# EAGLE design board_1.2v (EAGLE 7.7.0)
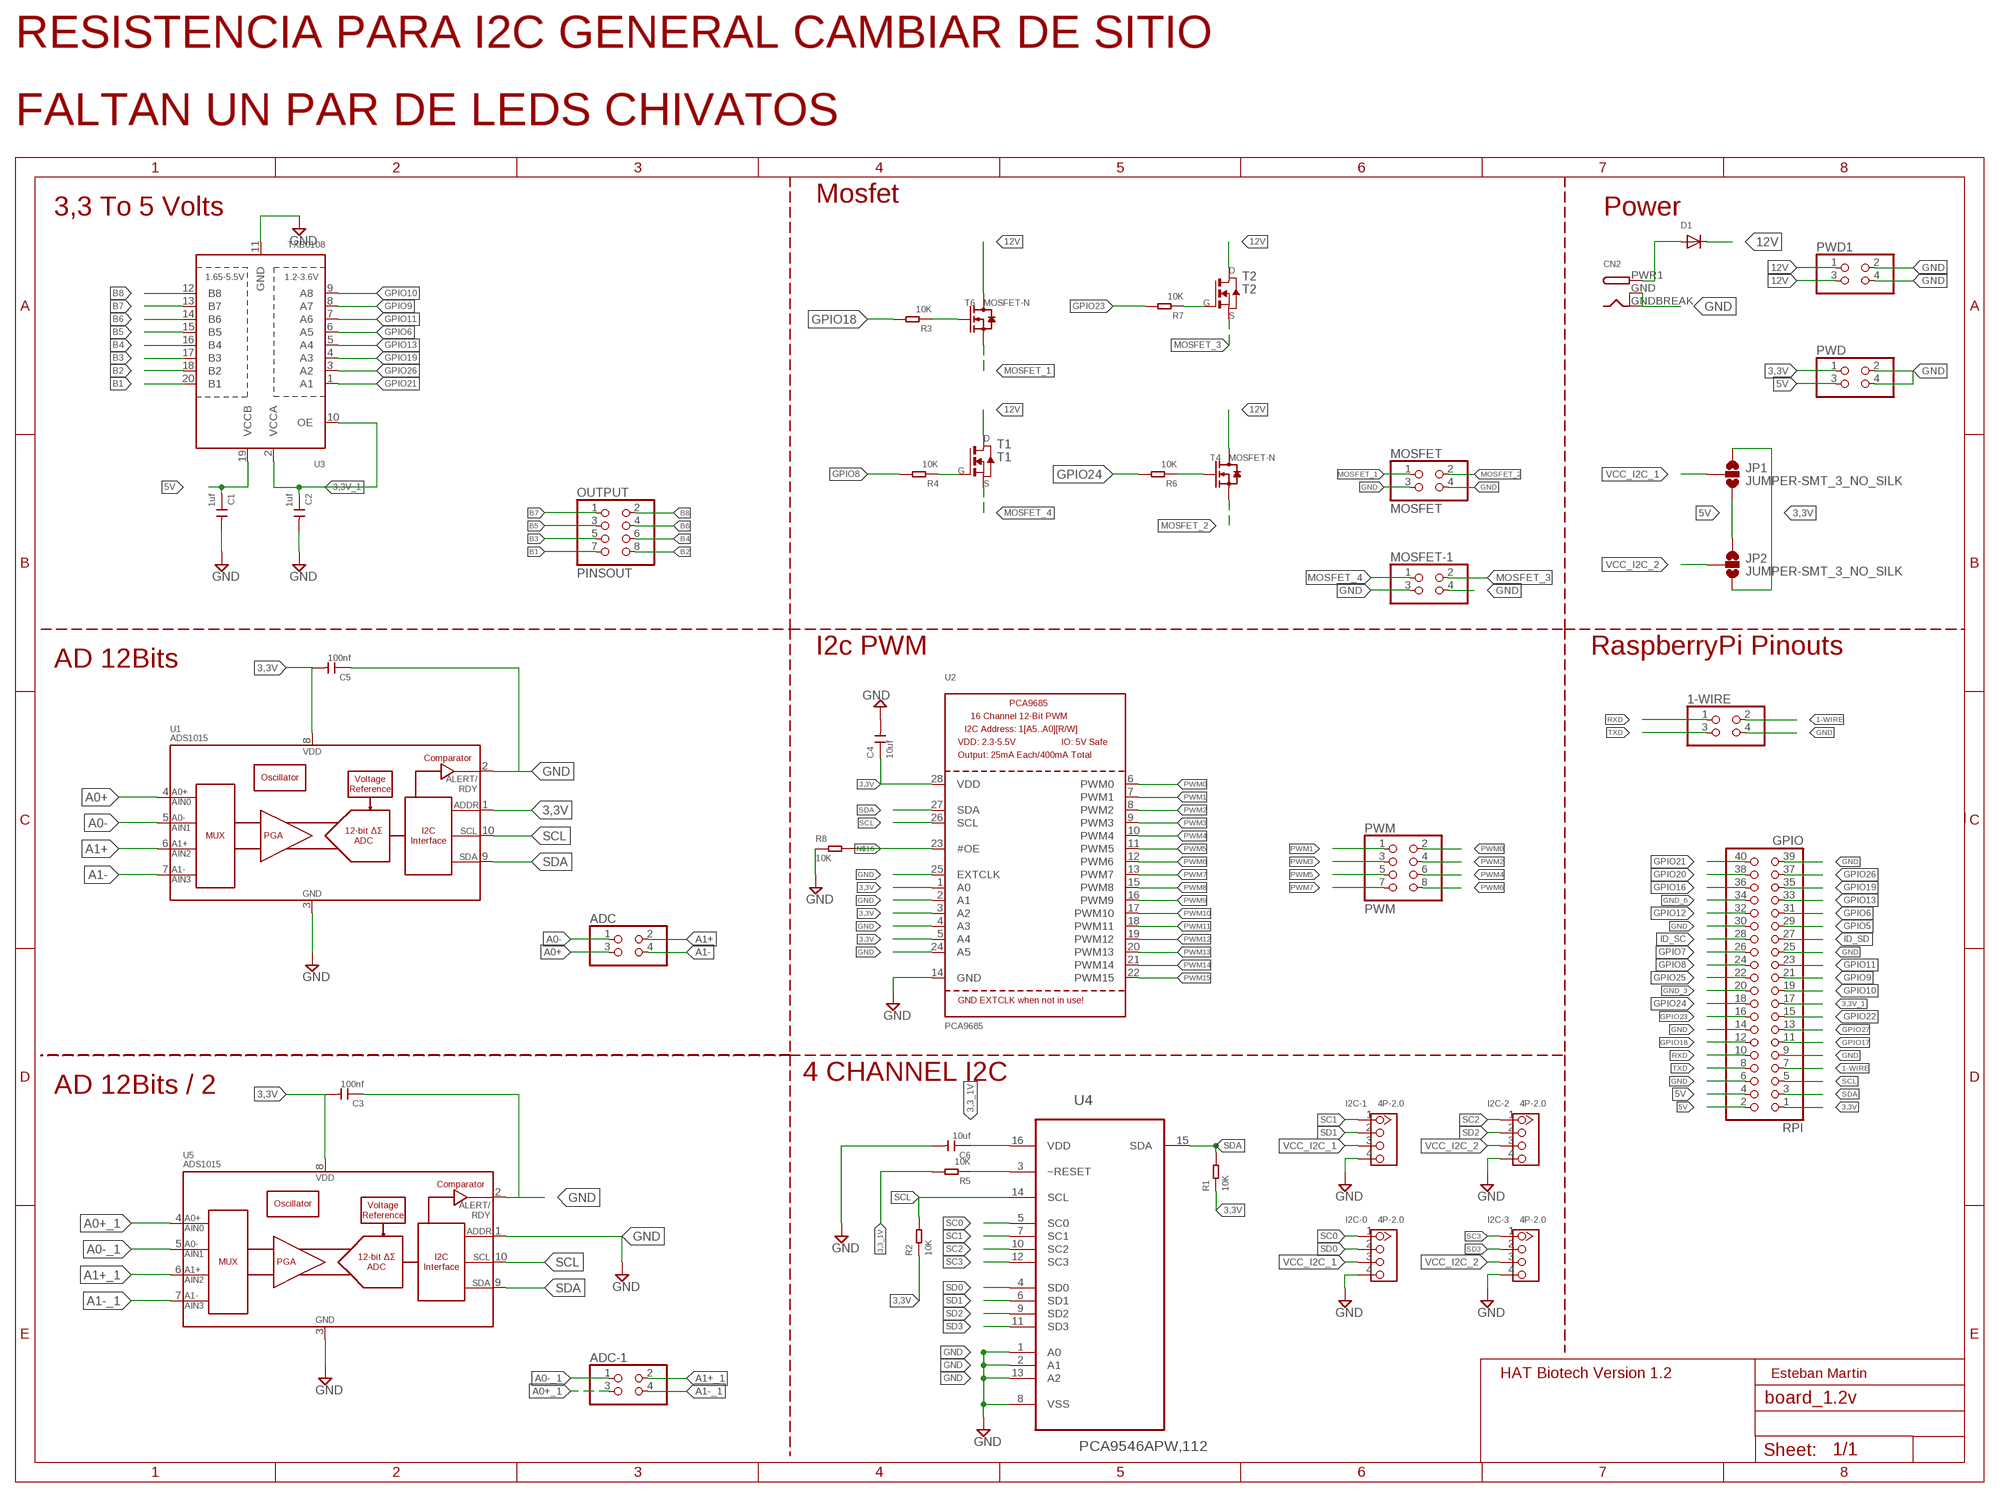
[diagram p0: schematic, sheet 1]

## Parts
1-WIRE  PINHD-2X2  [2X02]
ADC  PINHD-2X2  [2X02]
ADC-1  PINHD-2X2  [2X02]
C1  1uf  CERAMIC-1UF-25V-10%-X7R(0805)  [C0805]
C2  1uf  CERAMIC-1UF-25V-10%-X7R(0805)  [C0805]
C3  100nf  CERAMIC-100NF-50V-10%-X7R(0805)  [C0805]
C4  10uf  CERAMIC-1UF-25V-10%-X7R(0805)  [C0805]
C5  100nf  CERAMIC-100NF-50V-10%-X7R(0805)  [C0805]
C6  10uf  CERAMIC-1UF-25V-10%-X7R(0805)  [C0805]
CN2  DCBARRELSMT  [DCJACK_2MM_SMT]
D1  DIODESOD-123  [SOD-123]
I2C-0  4P-2.0  GROVE-CONNECTOR-DIP(4P-2.0)  [HW4-2.0]
I2C-1  4P-2.0  GROVE-CONNECTOR-DIP(4P-2.0)  [HW4-2.0]
I2C-2  4P-2.0  GROVE-CONNECTOR-DIP(4P-2.0)  [HW4-2.0]
I2C-3  4P-2.0  GROVE-CONNECTOR-DIP(4P-2.0)  [HW4-2.0]
JP1  JUMPER-SMT_3_NO_SILK  [SMT-JUMPER_3_NO_SILK]
JP2  JUMPER-SMT_3_NO_SILK  [SMT-JUMPER_3_NO_SILK]
MOSFET  MOSFET  PINHD-2X2  [2X02]
MOSFET-1  PINHD-2X2  [2X02]
OUTPUT  PINSOUT  PINHD-2X4  [2X04]
PWD  PINHD-2X2  [2X02]
PWD1  PINHD-2X2  [2X02]
PWM  PWM  PINHD-2X4  [2X04]
R1  10K  SMD-RES-10K-1%-1/8W(0805)  [R0805]
R2  10K  SMD-RES-10K-1%-1/8W(0805)  [R0805]
R3  10K  SMD-RES-10K-1%-1/8W(0805)  [R0805]
R4  10K  SMD-RES-10K-1%-1/8W(0805)  [R0805]
R5  10K  SMD-RES-10K-1%-1/8W(0805)  [R0805]
R6  10K  SMD-RES-10K-1%-1/8W(0805)  [R0805]
R7  10K  SMD-RES-10K-1%-1/8W(0805)  [R0805]
R8  10K  SMD-RES-10K-1%-1/8W(0805)  [R0805]
RPI  GPIO  PINHD-2X20  [2X20]
T1  T1  NMOSFETTO252  [TO252]
T2  T2  NMOSFETTO252  [TO252]
T4  MOSFET-N  [SOT-23]
T6  MOSFET-N  [SOT-23]
U1  ADS1015  [MSOP10]
U2  PCA9685  [TSSOP28]
U3  TXB0108  TXB0108PWR  [TSSOP20]
U4  PCA9546APW,112  [SOP65P640X110-16N]
U5  ADS1015  [MSOP10]

## Nets
1-WIRE: 1-WIRE.2 RPI.7
3,3_1V: C6.1 R5.2 U4.16(VDD)
3,3V: C3.2 C4.1 C5.2 JP1.1 JP2.3 PWD.1 R1.1 R2.1 RPI.1 U1.1(ADDR) U1.8(VDD) U2.1(A0) U2.3(A2) U2.5(A4) U2.28(VDD) U5.8(VDD)
3,3V_1: C2.1 RPI.17 U3.2(VCCA) U3.10(OE)
5V: C1.1 JP1.3 JP2.1 PWD.3 RPI.2 RPI.4 U3.19(VCCB)
12V: D1.C PWD1.1 PWD1.3 T1.3(D) T2.3(D) T4.3(D) T6.3(D)
A0+: ADC.3 U1.4(AIN0)
A0+_1: ADC-1.3 U5.4(AIN0)
A0-: ADC.1 U1.5(AIN1)
A0-_1: ADC-1.1 U5.5(AIN1)
A1+: ADC.2 U1.6(AIN2)
A1+_1: ADC-1.2 U5.6(AIN2)
A1-: ADC.4 U1.7(AIN3)
A1-_1: ADC-1.4 U5.7(AIN3)
B1: OUTPUT.7 U3.20(B1)
B2: OUTPUT.8 U3.18(B2)
B3: OUTPUT.5 U3.17(B3)
B4: OUTPUT.6 U3.16(B4)
B5: OUTPUT.3 U3.15(B5)
B6: OUTPUT.4 U3.14(B6)
B7: OUTPUT.1 U3.13(B7)
B8: OUTPUT.2 U3.12(B8)
GND: 1-WIRE.4 C1.2 C2.2 C3.1 C4.2 C5.1 C6.2 CN2.GND(GNDBREAK) CN2.GNDBREAK(GND) I2C-0.4 I2C-1.4 I2C-2.4 I2C-3.4 MOSFET-1.3 MOSFET-1.4 MOSFET.3 MOSFET.4 PWD1.2 PWD1.4 PWD.2 PWD.4 R8.1 RPI.6 RPI.9 RPI.14 RPI.25 RPI.30 RPI.39 U1.2(ALERT/RDY) U1.3(VSS) U2.2(A1) U2.4(A3) U2.14(GND) U2.24(A5) U2.25(EXTCLK) U3.11(GND) U4.1(A0) U4.2(A1) U4.8(VSS) U4.13(A2) U5.1(ADDR) U5.2(ALERT/RDY) U5.3(VSS)
GND_3: RPI.20
GND_6: RPI.34
GPIO5: RPI.29
GPIO6: RPI.31 U3.6(A5)
GPIO7: RPI.26
GPIO8: R4.2 RPI.24
GPIO9: RPI.21 U3.8(A7)
GPIO10: RPI.19 U3.9(A8)
GPIO11: RPI.23 U3.7(A6)
GPIO12: RPI.32
GPIO13: RPI.33 U3.5(A4)
GPIO16: RPI.36
GPIO17: RPI.11
GPIO18: R3.2 RPI.12
GPIO19: RPI.35 U3.4(A3)
GPIO20: RPI.38
GPIO21: RPI.40 U3.1(A1)
GPIO22: RPI.15
GPIO23: R7.2 RPI.16
GPIO24: R6.2 RPI.18
GPIO25: RPI.22
GPIO26: RPI.37 U3.3(A2)
GPIO27: RPI.13
ID_SC: RPI.28
ID_SD: RPI.27
MOSFET_1: MOSFET.1 T6.2(S)
MOSFET_2: MOSFET.2 T4.2(S)
MOSFET_3: MOSFET-1.2 T2.2(S)
MOSFET_4: MOSFET-1.1 T1.2(S)
N$2: CN2.PWR1(PWR) D1.A
N$6: R3.1 T6.1(G)
N$7: R5.1 U4.3(~RESET)
N$9: R4.1 T1.1(G)
N$10: R6.1 T4.1(G)
N$11: R7.1 T2.1(G)
N$16: R8.2 U2.23(#OE)
PWM0: PWM.2 U2.6(PWM0)
PWM1: PWM.1 U2.7(PWM1)
PWM2: PWM.4 U2.8(PWM2)
PWM3: PWM.3 U2.9(PWM3)
PWM4: PWM.6 U2.10(PWM4)
PWM5: PWM.5 U2.11(PWM5)
PWM6: PWM.8 U2.12(PWM6)
PWM7: PWM.7 U2.13(PWM7)
PWM8: U2.15(PWM8)
PWM9: U2.16(PWM9)
PWM10: U2.17(PWM10)
PWM11: U2.18(PWM11)
PWM12: U2.19(PWM12)
PWM13: U2.20(PWM13)
PWM14: U2.21(PWM14)
PWM15: U2.22(PWM15)
RXD: 1-WIRE.1 RPI.10
SC0: I2C-0.1 U4.5(SC0)
SC1: I2C-1.1 U4.7(SC1)
SC2: I2C-2.1 U4.10(SC2)
SC3: I2C-3.1 U4.12(SC3)
SCL: R2.2 RPI.5 U1.10(SCL) U2.26(SCL) U4.14(SCL) U5.10(SCL)
SD0: I2C-0.2 U4.4(SD0)
SD1: I2C-1.2 U4.6(SD1)
SD2: I2C-2.2 U4.9(SD2)
SD3: I2C-3.2 U4.11(SD3)
SDA: R1.2 RPI.3 U1.9(SDA) U2.27(SDA) U4.15(SDA) U5.9(SDA)
TXD: 1-WIRE.3 RPI.8
VCC_I2C_1: I2C-0.3 I2C-1.3 JP1.2
VCC_I2C_2: I2C-2.3 I2C-3.3 JP2.2

## Notes on the sheet
- RESISTENCIA PARA I2C GENERAL CAMBIAR DE SITIO
- FALTAN UN PAR DE LEDS CHIVATOS
- Mosfet
- 3,3 To 5 Volts | Power
- I2c PWM | RaspberryPi Pinouts
- AD 12Bits
- 4 CHANNEL I2C
- AD 12Bits / 2
- HAT Biotech Version 1.2 | Esteban Martin

## Library data of the parts
1-WIRE ADC ADC-1 MOSFET MOSFET-1 PWD PWD1 = pinhead:PINHD-2X2: PIN HEADER
C1 C2 = Seeed-OPL-Capacitor:CERAMIC-1UF-25V-10%-X7R(0805): 302010179; MPN: CC0805KKX7R8BB105
C3 C5 = Seeed-OPL-Capacitor:CERAMIC-100NF-50V-10%-X7R(0805): 302010165; MPN: CC0805KRX7R9BB104
C4 C6 = Seeed-OPL-Capacitor:CERAMIC-1UF-25V-10%-X7R(0805): 302010179; MPN: CC0805KKX7R8BB105; VALUE: 1uf
CN2 = adafruit:DCBARREL: 2.0mm DC Barrel Jack DCJACK_2MM_PTH - Through Hole Jack (4UConnector: 05537)
D1 = adafruit:DIODE: Diode SMADIODE - SMA Surface Mount Package 20V 1A Schottky Diode Digikey: 641-1014-6-ND DO-1N4148 - Through Hole Small Current Diode SOD-123 20V 1 A (.5mV Vf) Schottky Diode - Digikey: MBRX120TPMSCT-ND SOD-323 10V 570mA (.38mV Vf, 3ns) Schottky Diode - Digikey: ZLLS410CT-ND SOD-523 30V 30mA Schottky Diode (RB751S-40TE61) - Digikey: RB751S-40TE61CT-ND SOT23-R/W - SOT23 Package (R = Solder Paste/Reflow Ovens, W = Hand-Soldering) BAT54Film 40V 300mA - Digikey: 497-7162-1-ND
I2C-0 I2C-1-I2C-3 = Seeed-OPL-Connector:GROVE-CONNECTOR-DIP(4P-2.0): 320110033
JP1 JP2 = SparkFun-Jumpers:JUMPER-SMT_3_NO: Normally open jumper This jumper has three pads in close proximity to each other. Apply solder to close the connection(s).
OUTPUT PWM = adafruit:PINHD-2X4: PIN HEADER
R1-R8 = Seeed-OPL-Resistor:SMD-RES-10K-1%-1/8W(0805): 301010361; MPN: RC0805FR-0710KL
RPI = adafruit:PINHD-2X20: PIN HEADER
T1 T2 = fab_2:NMOSFET: MOS FET
T4 T6 = Seeed-OPL-Transistor:MOSFET-N
U1 U5 = SparkFun-IC-Conversion:ADS1015: ADS1015 12-BIT ADC 12-Bit Del-Sig ADC Four single-ended inputs or two differential inputs Internal PGA I2C interface 2.0-5.5V SparkFun Products SparkFun Block for Intel Edison - ADC <https://www.sparkfun.com/products/13770> (DEV-13770); PROD_ID: IC-12270
U2 = adafruit:PCA9685: PCA9685 - 16 Channel 12-Bit I2C PWM Controller 5.0V tolerant 16 channel, 12-bit I2C PWM controller with 25mA per output (max. 400mA total) Digikey: 568-5931-1-ND
U3 = adafruit:TXB0108PWR: 8-Bit Bi-Directional Level Shifter 1.2V-3.6V (VCCA) to 1.65V-5.5V (VCCB) bi-directional level shifter with auto direction sensing. Max data rate - VCCA 1.8V: 20Mbps (50ns), VCCA 3.3V: 100Mbps (10ns) Digikey: 296-21527-1-ND
U4 = NXP_By_element14_Batch_1:PCA9546APW,112: 4-channel I2C-bus switch with reset; MPN: PCA9546APW,112; OC_FARNELL: 1831208; OC_NEWARK: 70R6610; PACKAGE: TSSOP-16; SUPPLIER: NXP

## Board
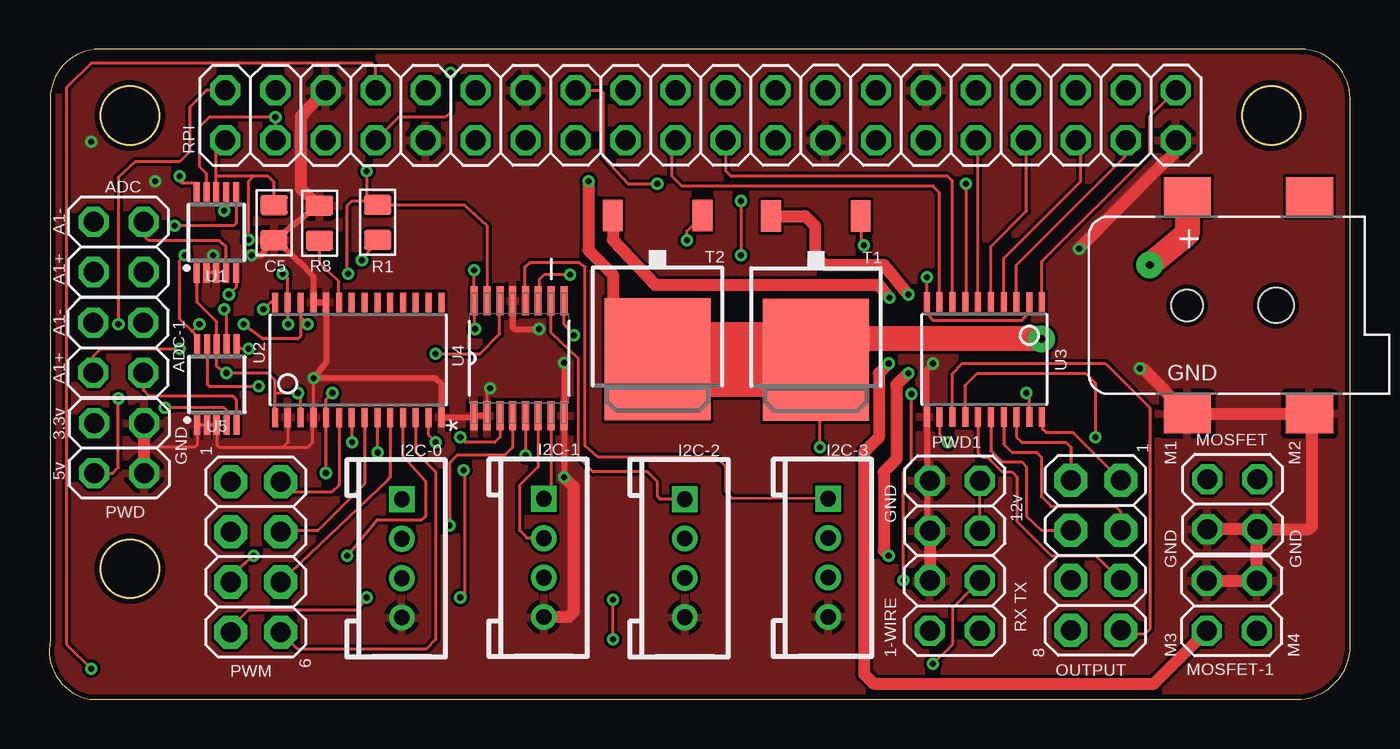
[diagram p1: board, top side]
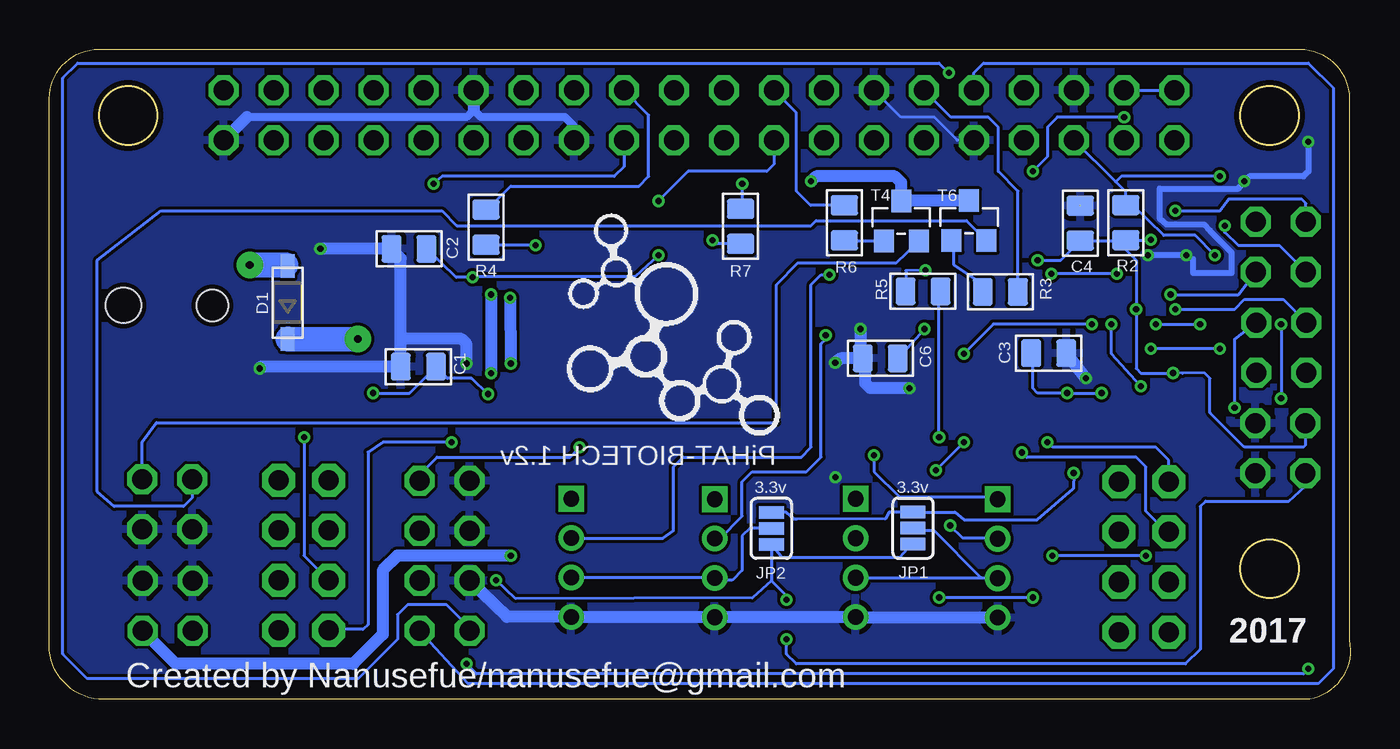
[diagram p2: board, bottom side, seen from below]

Size 66.06 x 33 mm. Coordinates in mm from the lower left corner, seen from the top.
Outline: 0.05,30.5 0.05,3 arc90 2.05,0 63.55,0 arc90 66.05,3 66.05,30.5 arc90 63.55,33 2.55,33 arc90 0.05,30.5
Outline: circle at 62.05,29.64 radius 1.48
Outline: circle at 4.09,29.64 radius 1.48
Outline: circle at 4.09,6.63 radius 1.48
Copper layers (1*16): Top 0.035mm / dielectric 1.5mm / Bottom 0.035mm
Design rules "SeeedStudio_2layer_DRU_no_angle_20140221": minimum track width 6mil, minimum drill 12mil, track to track 6mil, track to pad 6mil, pad to pad 6mil, via to via 6mil, smd to smd 0mil, copper to edge 10mil, drill to drill 10mil, minimum pad ring 10mil, minimum via ring 6mil, stop-mask expansion 2mil, vias tented up to drill 100mil, thermal gap 10mil

### Footprints (pad centres in the part's own frame; a part is rotated, then mirrored left to right if it is on the bottom)
2X02 = drill 1.016 octagon: 1 -1.27,-1.27; 2 -1.27,1.27; 3 1.27,-1.27; 4 1.27,1.27
C0805 = smd 1.397 x 1.016: 1 0,0.889; 2 0,-0.889
DCJACK_2MM_SMT = smd 2.4 x 2: GND 0,-5.5; GNDBREAK 6.2,-5.5; PWR1 0,5.5; PWR2 6.2,5.5 | hole 1.6: 0,0 | hole 1.8: 4.5,0
SOD-123 = smd 1.2 x 0.7: A 1.85,0; C -1.85,0
HW4-2.0 = drill 0.8 pad 1.27 square: 1 -3,0 | drill 0.8 pad 1.27: 2 -1,0; 3 1,0; 4 3,0
SMT-JUMPER_3_NO_SILK = smd 0.635 x 1.27: 1 -0.813,0; 2 0,0; 3 0.813,0
2X04 = drill 1.016 pad 1.676 octagon: 1 -3.81,-1.27; 2 -3.81,1.27; 3 -1.27,-1.27; 4 -1.27,1.27; 5 1.27,-1.27; 6 1.27,1.27; 7 3.81,-1.27; 8 3.81,1.27
R0805 = smd 1.397 x 1.016: 1 0,0.889; 2 0,-0.889
2X20 = drill 1.016 octagon: 1 -24.13,-1.27; 2 -24.13,1.27; 3 -21.59,-1.27; 4 -21.59,1.27; 5 -19.05,-1.27; 6 -19.05,1.27; 7 -16.51,-1.27; 8 -16.51,1.27; 9 -13.97,-1.27; 10 -13.97,1.27; 11 -11.43,-1.27; 12 -11.43,1.27; 13 -8.89,-1.27; 14 -8.89,1.27; 15 -6.35,-1.27; 16 -6.35,1.27; 17 -3.81,-1.27; 18 -3.81,1.27; 19 -1.27,-1.27; 20 -1.27,1.27; 21 1.27,-1.27; 22 1.27,1.27; 23 3.81,-1.27; 24 3.81,1.27; 25 6.35,-1.27; 26 6.35,1.27; 27 8.89,-1.27; 28 8.89,1.27; 29 11.43,-1.27; 30 11.43,1.27; 31 13.97,-1.27; 32 13.97,1.27; 33 16.51,-1.27; 34 16.51,1.27; 35 19.05,-1.27; 36 19.05,1.27; 37 21.59,-1.27; 38 21.59,1.27; 39 24.13,-1.27; 40 24.13,1.27
TO252 = smd 1 x 1.6: 1 -2.28,-4.8; 2 2.28,-4.8 | smd 5.4 x 6.2: 3 0,2.5
SOT-23 = smd 1.016 x 1.143: 1 -0.889,-1.016; 2 0.889,-1.016; 3 0,1.016
MSOP10 = smd 0.3 x 1: 1 -1,-2.05; 2 -0.5,-2.05; 3 0,-2.05; 4 0.5,-2.05; 5 1,-2.05; 6 1,2.05; 7 0.5,2.05; 8 0,2.05; 9 -0.5,2.05; 10 -1,2.05
TSSOP28 = smd 0.305 x 0.991: 1 -4.225,-2.918; 2 -3.575,-2.918; 3 -2.925,-2.918; 4 -2.275,-2.918; 5 -1.625,-2.918; 6 -0.975,-2.918; 7 -0.325,-2.918; 8 0.325,-2.918; 9 0.975,-2.918; 10 1.625,-2.918; 11 2.275,-2.918; 12 2.925,-2.918; 13 3.575,-2.918; 14 4.225,-2.918; 15 4.225,2.918; 16 3.575,2.918; 17 2.925,2.918; 18 2.275,2.918; 19 1.625,2.918; 20 0.975,2.918; 21 0.325,2.918; 22 -0.325,2.918; 23 -0.975,2.918; 24 -1.625,2.918; 25 -2.275,2.918; 26 -2.925,2.918; 27 -3.575,2.918; 28 -4.225,2.918
TSSOP20 = smd 0.305 x 0.991: 1 -2.925,-2.918; 2 -2.275,-2.918; 3 -1.625,-2.918; 4 -0.975,-2.918; 5 -0.325,-2.918; 6 0.325,-2.918; 7 0.975,-2.918; 8 1.625,-2.918; 9 2.275,-2.918; 10 2.925,-2.918; 11 2.925,2.918; 12 2.275,2.918; 13 1.625,2.918; 14 0.975,2.918; 15 0.325,2.918; 16 -0.325,2.918; 17 -0.975,2.918; 18 -1.625,2.918; 19 -2.275,2.918; 20 -2.925,2.918
SOP65P640X110-16N = smd 1.473 x 0.356: 1 -2.921,2.286; 2 -2.921,1.626; 3 -2.921,0.965; 4 -2.921,0.33; 5 -2.921,-0.33; 6 -2.921,-0.965; 7 -2.921,-1.626; 8 -2.921,-2.286; 9 2.921,-2.286; 10 2.921,-1.626; 11 2.921,-0.965; 12 2.921,-0.33; 13 2.921,0.33; 14 2.921,0.965; 15 2.921,1.626; 16 2.921,2.286

### Placement (x,y rotation side)
1-WIRE  45.98,4.76 90 top
ADC  3.52,22.96 90 top
ADC-1  3.51,17.86 90 top
C1  47.32,16.89 270 bottom
C2  47.8,22.87 270 bottom
C3  15.32,17.57 270 bottom
C4  13.72,24.18 180 bottom
C5  11.41,24.2 180 top
C6  23.86,17.31 270 bottom
CN2  57.79,20 0 top
D1  53.95,20.14 90 bottom
I2C-0  17.9,7.16 270 top
I2C-1  25.12,7.18 270 top
I2C-2  32.27,7.16 270 top
I2C-3  39.55,7.19 270 top
JP1  22.2,8.7 270 bottom
JP2  29.39,8.68 90 bottom
MOSFET  60.08,9.91 270 top
MOSFET-1  60.05,4.75 90 top
OUTPUT  53.13,7.31 90 top
PWD  3.54,12.76 270 top
PWD1  45.99,9.83 90 top
PWM  10.48,7.23 270 top
R1  16.68,24.21 180 top
R2  11.4,24.2 180 bottom
R3  17.77,20.69 90 bottom
R4  43.89,23.97 180 bottom
R5  21.69,20.71 270 bottom
R6  25.68,24.19 180 bottom
R7  30.95,24.01 180 bottom
R8  13.72,24.17 0 top
RPI  33.07,29.65 0 top
T1  38.93,19.73 180 top
T2  30.89,19.76 180 top
T4  22.8,24.28 0 bottom
T6  19.36,24.3 0 bottom
U1  8.49,23.7 0 top
U2  15.69,17.24 0 top
U3  47.49,17.26 180 top
U4  23.86,17.32 90 top
U5  8.51,15.98 0 top

### Tracks (layer width: path | path; a pad name or v marks a point on that pad's centre or on a via)
1-WIRE  (via drill 0.31)
  Top 0.16: v20.37,31.8 20.37,29.8 20.12,29.55 17.74,29.55 RPI.7
  Bottom 0.16: 1-WIRE.2 44.71,3.63 45.87,4.8 47.87,4.8 48.37,4.3 48.37,3.05 50.37,1.05 64.12,1.05 65.37,2.3 65.37,31.55 64.62,32.3 20.87,32.3 v20.37,31.8
3,3_1V  (via drill 0.31)
  Top 0.16: v21.62,18.8 21.57,19.1 U4.16 21.57,21.6 v21.56,21.78
  Bottom 0.16: v21.62,18.8 C6.1 | v21.56,21.78 22.57,21.77 R5.2
3,3V  (via drill 0.31)
  Top 0.16: U1.8 8.49,26.55 | 8.49,26.55 8.49,27.92 RPI.1 | U1.1 7.49,20.19 8.51,19.16 U5.8 8.49,16.92 v8.99,16.57 9.01,16.55 11.12,16.55 11.46,16.21 11.46,15.55 | U2.1 11.46,15.55 | U2.3 12.76,15.41 v12.62,15.55 11.46,15.55 | v14.37,15.55 14.06,15.24 U2.5 14.04,14.25 v14.04,11.49 | U2.28 11.23,20.16 v10.87,19.8 | C5.2 11.41,26.26 11.12,26.55 10.37,26.55 | 10.37,26.55 8.49,26.55 | v10.13,23.33 10.12,26.3 10.37,26.55 | R1.1 16.12,22.6 v15.87,22.3
  Bottom 0.16: JP2.3 28.62,9.49 28.22,9.15 28.09,9.15 23.6,9.16 23.42,9.51 JP1.1 20.08,9.51 19.62,9.12 15.87,9.12 14.05,10.7 v14.04,11.49 | C3.2 16.12,17.49 16.12,15.8 15.87,15.55 v14.37,15.55 v12.62,15.55 | v8.99,16.57 7.37,16.55 7.12,16.3 7.12,14.55 5.37,12.8 2.37,12.8 2.27,12.9 PWD.1 | 8.51,16.55 v8.99,16.57 | v8.99,16.57 9.01,16.55 10.62,16.55 10.87,16.8 v10.87,19.8 10.87,22.3 11.4,22.83 R2.1 | R2.1 11.43,23.29 C4.1 14.7,22.3 v15.87,22.3 | R2.1 10.36,23.31 v10.13,23.33
3,3V_1  (via drill 0.31)
  Top 0.16: v44.57,21.43 44.56,20.99 U3.10 44.62,20.11 44.62,19.55 44.87,19.23 49.37,19.22 49.76,19.69 U3.2 | v35.12,25.3 v35.12,22.55
  Bottom 0.16: C2.1 45.4,21.42 v44.57,21.43 44.5,21.46 36.31,21.46 v35.12,22.55 | RPI.17 29.26,27.16 29.62,26.8 33.62,26.8 v35.12,25.3
5V  (via drill 0.31)
  Top 0.16: U3.19 49.76,15.41 v49.62,15.55 | RPI.2 7.99,30.92 7.12,30.05 7.12,27.8 6.62,27.3 4.37,27.3 3.49,26.5 v3.51,19.04 | v43.37,6.05 43.37,11.55 43.77,12 v43.77,15.5 | v28.62,3.05 v28.62,5.05 | v3.51,15.28 3.51,11.78 3.21,11.49 PWD.3
  Bottom 0.16: JP1.3 22.29,7.88 22.89,7.2 28.84,7.2 JP2.1 29.39,6.03 | v49.62,15.55 47.77,15.55 C1.1 45.84,16.3 44.62,16.3 v43.77,15.5 | RPI.4 RPI.2 | v3.51,19.04 v3.51,15.28 | 29.39,6.03 30.36,5.15 42.37,5.12 v43.37,6.05 | v28.62,3.05 28.62,2.3 28.12,1.8 8.37,1.8 7.62,2.55 7.62,9.8 7.34,10.06 3.12,10.05 2.27,10.83 PWD.3 | v28.62,5.05 28.62,5.26 29.39,6.03
12V  (via drill 0.31, 0.4 pad 1.35)
  Top 0.16: 38.9,17.26 T1.3 | 28.62,19.53 T2.3 | PWD1.1 PWD1.3 | 39.5,18.3 T1.3 | v39.12,12.8 39.12,17.04 T1.3
  Top 0.6: v50.38,18.3 50.38,18.29
  Top 0.61: v27.37,26.3 27.37,22.8 28.62,21.55 28.62,19.53
  Top 1.27: 50.38,18.29 50.37,18.3 39.5,18.3 | v50.39,18.3 v50.38,18.3
  Top 3.81: T2.3 38.9,17.26
  Bottom 0.16: PWD1.3 47.26,11.41 46.37,12.3 39.62,12.3 v39.12,12.8
  Bottom 0.61: T6.3 21.78,25.31 T4.3 22.8,26.22 23.12,26.55 27.12,26.55 v27.37,26.3
  Bottom 1.27: D1.C v50.39,18.3
A0+
  Top 0.16: U1.4 8.98,22.99 8.63,23.29 5.06,23.29 4.77,23.55 ADC.3
A0+_1  (via drill 0.31)
  Top 0.16: U5.4 9.01,14.66 8.87,14.8 v5.87,14.8
  Bottom 0.16: v5.87,14.8 5.87,18.28 ADC-1.3
A0-  (via drill 0.31)
  Top 0.16: U1.5 9.49,20.91 v9.12,20.55
  Bottom 0.16: v9.12,20.55 5.68,20.55 ADC.1
A0-_1
  Top 0.16: U5.5 9.51,15.16 9.33,15.38 5.08,15.38 4.78,15.68 ADC-1.1
A1+  (via drill 0.31)
  Top 0.16: U1.6 9.49,24.16 9.37,24.05 v6.37,24.05
  Bottom 0.16: v6.37,24.05 6.37,23.7 5.67,23.05 3.6,23.05 ADC.2
A1+_1  (via drill 0.31)
  Top 0.16: ADC-1.2 2.24,17.41 2.62,17.8 v6.62,17.8 | v10.12,17.8 9.74,17.8 U5.6
  Bottom 0.16: v6.62,17.8 v10.12,17.8
A1-  (via drill 0.31)
  Top 0.16: U1.7 8.99,24.94 v8.87,24.8
  Bottom 0.16: ADC.4 2.25,25.17 2.47,25.4 6.17,25.4 6.62,24.8 v8.87,24.8
A1-_1  (via drill 0.31)
  Top 0.16: U5.7 9.01,19.66 v8.87,19.8
  Bottom 0.16: v8.87,19.8 5.87,19.8 5.37,20.3 3.41,20.3 ADC-1.4
B1
  Top 0.16: U3.20 50.42,13.75 50.5,13.67 50.62,13.55 51.76,13.55 51.96,13.56 53.29,12.24 54.37,11.15 OUTPUT.7
B2
  Top 0.16: U3.18 49.11,13.31 49.37,13.05 51.62,13.05 51.87,12.8 51.87,11.13 OUTPUT.8
B3
  Top 0.16: U3.17 48.46,12.96 48.87,12.55 50.12,12.55 50.37,12.3 50.37,10.3 50.87,9.8 54.12,9.8 54.37,9.55 54.37,8.61 OUTPUT.5
B4
  Top 0.16: U3.16 47.81,12.61 48.37,12.05 49.37,12.05 49.62,11.8 49.62,9.3 50.38,8.58 51.81,8.58 OUTPUT.6
B5
  Top 0.16: U3.15 47.16,12.51 47.37,12.3 47.62,12.3 48.37,11.55 48.87,11.55 49.12,11.3 49.12,9.05 49.87,8.3 50.89,7.29 51.62,7.3 53.14,7.3 OUTPUT.3
B6  (via drill 0.31)
  Top 0.16: U3.14 46.51,15.94 47.12,16.55 52.62,16.55 53.12,16.05 v53.12,13.3
  Bottom 0.16: v53.12,13.3 53.12,7.3 OUTPUT.4
B7
  Top 0.16: U3.13 45.86,16.54 46.37,17.05 53.62,17.05 55.87,14.8 55.87,3.55 55.62,3.3 54.6,3.3 OUTPUT.1
B8  (via drill 0.31)
  Top 0.16: U3.12 45.21,13.46 v45.62,13.05
  Bottom 0.16: v45.62,13.05 49.12,13.05 49.87,12.55 49.87,3.8 50.12,3.55 51.81,3.55 OUTPUT.2
GND  (via drill 0.31, 0.32)  (1 unrouted)
  Top 0.16: v13.42,16.3 13.41,15.59 U2.4 13.37,14.28 13.37,13.05 13.12,12.8 11.87,12.8 | 11.87,12.8 8.62,12.8 8.51,12.91 U5.3 U5.2 U5.1 7.51,12.94 7.37,12.8 4.81,12.8 | U1.2 U1.3 8.49,22.41 v8.32,22.54 | U2.2 12.11,13.04 11.87,12.8 | v22.37,15.8 22.23,15.66 U4.2
  Top 0.3: v26.14,11.28 U4.8 26.15,14.45 v26.15,17.08 | 44.56,8.72 U3.11 44.56,16.74 v44.87,17.05 | U4.13 23.53,18.9 23.62,18.8 v24.87,18.8 | U4.2 U4.1 21.5,14.32 U2.14 19.91,16.01 19.62,16.3 v13.42,16.3 14.06,17.12 U2.24 U2.25 13.41,21.41 13.41,21.46 12.65,22.23 11.48,23.32 | v10.27,22.55 10.77,22.55 C5.1 13.65,25.08
  Top 0.6: v26.14,11.28 v26.13,11.28 26.62,10.8 26.62,4.43 26.37,4.18 I2C-1.4 | v55.37,16.8 55.49,16.8 CN2.GND CN2.GNDBREAK 64.12,14.37 64.12,8.8 63.96,8.64 MOSFET.4 | v52.29,22.87 56.42,27.05 57.15,27.78 RPI.39 | MOSFET.4 MOSFET.3 | MOSFET-1.4 MOSFET-1.3 61.32,8.61 MOSFET.4 | 44.56,8.72 PWD1.2 44.72,6.05 1-WIRE.4 | RPI.6 14.02,30.95 12.77,29.6 12.77,25.91 R8.1 13.65,25.08 | 11.48,23.32 C5.1 | PWD.4 4.81,12.8 PWD.2
  Bottom 0.16: RPI.9 19.95,28.38 21.12,29.55 22.82,29.55 RPI.14
  Bottom 0.3: v10.27,22.55 v8.32,22.54 7.99,22.34 U1.2 6.47,21.65 6.37,21.65 6.02,21.65 6.02,22.68 7,23.66 7.12,23.8 7.41,24.1 9.31,24.1 9.67,24.4 9.67,25.92 5.67,25.92 v5.37,26.3 5.12,26.55 2.37,26.55 2.12,26.8 v2.12,28.3
  Bottom 0.406: 56.03,29.55 44.87,29.55 44.5,29.92 44.13,29.55 39.87,29.55 39.42,29.1 RPI.25
  Bottom 0.6: I2C-0.4 25.09,4.16 I2C-1.4 32.26,4.18 I2C-2.4 39.48,4.17 I2C-3.4 42.82,4.19 1-WIRE.4 | v55.37,16.8 55.29,16.89 C1.2 48.21,18.3 | v52.29,22.87 C2.2 48.21,22.39 48.21,18.3 | v13.42,16.3 14.37,17.52 C3.1 | C6.2 25.87,17.31 v26.15,17.08 | RPI.30 44.5,29.92 | 56.03,29.55 RPI.39 | v24.87,18.8 24.87,17.43 C6.2 | v22.37,15.8 24.37,15.8 24.62,16.05 24.62,17.18 C6.2 | v44.87,17.05 44.87,18.05 45.12,18.3 48.21,18.3
  pour Bottom: 2.47,33.45 64.36,33.45 arc-91 66.58,30.54 66.37,1.99 arc-89 63.89,-0.48 3.58,-0.4 arc-90 -0.46,1.92 -0.64,30.49 arc-90
  pour Top: 2.48,33.57 64.8,33.59 arc-91 66.6,30.42 66.65,2.02 arc-89 64.16,-0.44 2.1,-0.48 arc-90 -0.58,1.87 -0.59,29.07 arc-90
GPIO6
  Top 0.16: U3.6 47.16,28.26 RPI.31
GPIO8
  Bottom 0.16: R4.2 43.82,24.85 42.62,26.05 36.12,26.05 35.62,26.55 35.62,29.66 RPI.24
GPIO9
  Top 0.16: U3.8 45.86,26.31 45.62,26.55 34.62,26.55 34.37,26.8 34.37,28.35 RPI.21
GPIO10
  Top 0.16: U3.9 45.21,25.71 44.87,26.05 32.12,26.05 31.62,26.55 31.62,28.2 RPI.19
GPIO11  (via drill 0.31)
  Top 0.16: v46.54,26.18 46.53,20.12 U3.7
  Bottom 0.16: RPI.23 36.88,27.04 37.37,26.55 46.12,26.55 v46.54,26.18
GPIO13
  Top 0.16: U3.5 47.81,22.99 49.62,24.8 49.62,28.34 RPI.33
GPIO18
  Bottom 0.16: R3.2 16.88,25.8 17.87,26.8 17.87,29.05 18.37,29.55 20.28,29.55 RPI.12
GPIO19
  Top 0.16: U3.4 48.46,22.39 52.37,26.3 52.37,28.13 RPI.35
GPIO21
  Top 0.16: U3.1 50.41,22.24 55.87,27.7 55.87,29.59 RPI.40
GPIO23  (via drill 0.31)
  Top 0.16: RPI.16 28.01,30.92 28.12,30.8 28.12,27.55 29.39,26.17 v30.87,26.17
  Bottom 0.16: v30.87,26.17 30.87,24.98 R7.2
GPIO24
  Bottom 0.16: R6.2 27.41,25.08 28.12,25.8 28.12,29.78 RPI.18
GPIO26
  Top 0.16: U3.3 49.11,22.04 54.62,27.55 54.62,28.34 RPI.37
MOSFET_1
  Bottom 0.16: MOSFET.1 58.81,10.23 59.24,9.8 62.76,9.8 63.62,10.55 63.62,22.3 60.37,24.8 46.12,24.8 45.37,24.05 27.37,24.05 27.12,24.3 19.48,24.3 T6.2
MOSFET_2
  Bottom 0.16: MOSFET.2 61.35,13.08 60.62,14.05 29.12,14.05 29.12,21.05 28.04,22.16 23.05,22.16 T4.2
MOSFET_3  (via drill 0.31)
  Top 0.6: T2.2 28.62,23.31 30.77,21.04 42.12,21.05 v42.65,20.38 | v42.62,17.05 42.12,16.55 42.12,13.3 41.37,12.55 41.37,1.3 41.87,0.8 56.1,0.8 MOSFET-1.2
  Bottom 0.6: v42.65,20.38 v42.62,17.05
MOSFET_4  (via drill 0.31)
  Top 0.6: T1.2 38.39,24.53 38.87,24.05 38.87,22.55 39.37,22.05 42.37,22.05 v43.62,20.55 | v43.62,16.55 43,15.96 43,12.18 42.37,11.55 42.37,7.55 v42.62,7.3
  Bottom 0.6: v43.62,20.55 v43.62,16.55 | v42.62,7.3 48.37,7.3 49.12,6.55 49.12,3.3 50.62,1.8 59.64,1.8 MOSFET-1.1
N$2  (via drill 0.4 pad 1.35)
  Top 1.27: CN2.PWR1 57.79,23.64 v55.87,22.05
  Bottom 0.6: 54.04,22.05 D1.A
  Bottom 1.27: v55.87,22.05 54.04,22.05
N$6
  Bottom 0.16: R3.1 18.65,21.08 20.12,22.05 20.12,23.15 T6.1
N$7  (via drill 0.31)
  Top 0.16: U4.3 22.89,13.32 22.62,13.05 21.12,13.05 v20.87,13.3
  Bottom 0.16: v20.87,13.3 20.87,20.63 R5.1
N$9  (via drill 0.31)
  Top 0.16: T1.1 41.21,23.21 v41.37,23.05
  Bottom 0.16: v41.37,23.05 43.61,23.05 R4.1
N$10
  Bottom 0.16: T4.1 25.65,23.27 R6.1
N$11  (via drill 0.31)
  Top 0.16: v32.37,23.3 32.37,23.77 T2.1
  Bottom 0.16: R7.1 32.2,23.12 v32.37,23.3
N$16
  Top 0.16: U2.23 14.7,21.22 13.73,22.14 R8.2
PWM0
  Top 0.16: U2.6 14.71,10.88 14.34,10.52 12.2,10.52 PWM.2
PWM1  (via drill 0.31)
  Top 0.16: v15.37,13.05 U2.7
  Bottom 0.16: PWM.1 9.21,12.14 9.87,12.8 15.12,12.8 v15.37,13.05
PWM2
  Top 0.16: U2.8 16.01,10.94 13.62,8.55 11.8,8.55 PWM.4
PWM3  (via drill 0.31)
  Top 0.16: v16.67,12.53 16.67,14.09 U2.9
  Bottom 0.16: PWM.3 9.32,8.5 10.37,9.55 10.37,11.8 10.87,12.3 16.43,12.29 v16.67,12.53
PWM4
  Top 0.16: U2.10 17.31,11.62 17.31,11.28 17.18,11.13 PWM.6
PWM5  (via drill 0.31)
  Top 0.16: PWM.5 9.21,6.29 v10.37,7.3 | v15.12,7.3 16.65,9.12 18.9,9.12 19.12,9.3 19.12,11.05 17.97,12.34 17.97,14.27 U2.11
  Bottom 0.16: v10.37,7.3 v15.12,7.3
PWM6
  Top 0.16: U2.12 18.61,12.56 19.62,11.55 19.62,3.05 19.12,2.55 12.62,2.55 PWM.8
PWM7  (via drill 0.31)
  Top 0.16: PWM.7 9.21,3.64 10.12,4.55 15.62,4.55 v16.12,5.17 | v20.87,5.17 21.12,5.3 21.12,11.55 v21.03,11.64 | v19.62,13.05 19.27,13.42 19.26,14.19 U2.13
  Bottom 0.16: v16.12,5.17 v20.87,5.17 | v21.03,11.64 v19.62,13.05
RXD
  Bottom 0.16: RPI.10 19.1,31.82 18.62,32.3 2.12,32.3 0.87,31.05 0.87,1.55 1.62,0.8 44.8,0.8 1-WIRE.1
SC0  (via drill 0.31)
  Top 0.16: U4.5 24.19,13.46 v24.19,12.39
  Bottom 0.16: v24.19,12.39 24.18,11.57 22.88,10.27 17.78,10.28 I2C-0.1
SC1
  Top 0.16: U4.7 25.48,10.55 I2C-1.1
SC2
  Top 0.16: I2C-2.1 31.01,10.17 30.87,10.3 30.87,11.05 30.37,11.55 27.62,11.55 26.87,12.3 26.87,17.3 25.48,18.61 25.48,19.94 U4.10
SC3
  Top 0.16: I2C-3.1 34.66,10.2 34.37,10.55 34.37,11.8 33.87,12.3 27.87,12.3 27.2,12.87 27.21,21.95 26.9,22.16 24.4,22.16 24.12,21.95 24.12,20.3 U4.12
SCL  (via drill 0.31)
  Top 0.16: U1.10 7.49,26.19 6.74,26.19 6.62,26.3 v6.62,26.55 | U5.10 7.51,18.41 7.25,18.68 | 7.25,18.68 6.62,19.3 6.62,22.3 v6.87,22.55 | v9.87,19.05 10.87,18.3 12.62,18.3 12.76,18.44 U2.26 12.76,19.41 v13.12,19.05 | v7.62,19.05 7.25,18.68 | v19.62,17.55 21.87,17.55 22.87,18.55 22.87,20.22 U4.14
  Bottom 0.16: 11.91,26.27 11.4,25.76 R2.2 11.08,25.1 11.01,25.05 9.47,23.55 7.87,23.55 v6.87,22.55 | 11.91,26.27 RPI.5 | v6.62,26.55 11.62,26.55 11.91,26.27 | v9.87,19.05 v7.62,19.05 | v13.12,19.05 18.12,19.05 v19.62,17.55
SD0  (via drill 0.31)
  Top 0.16: U4.4 23.53,12.8 23.12,12.39 20.7,12.39 20.32,12 v20.32,8.83
  Bottom 0.16: v20.32,8.83 19.69,8.19 17.94,8.19 I2C-0.2
SD1
  Top 0.16: U4.6 24.82,11.81 23.88,10.86 23.88,8.58 24.26,8.19 25.1,8.19 I2C-1.2
SD2  (via drill 0.31)
  Top 0.16: v26.63,18.48 26.14,19.03 U4.9
  Bottom 0.16: I2C-2.2 32.01,8.17 30.87,9.3 30.87,11.05 30.37,11.55 27.62,11.55 26.87,12.3 26.87,18.05 26.63,18.29 v26.63,18.48
SD3  (via drill 0.31)
  Top 0.16: v26.44,21.55 25.12,21.55 24.87,21.3 24.87,20.29 U4.11
  Bottom 0.16: I2C-3.2 34.89,8.19 34.37,8.55 34.37,11.8 33.87,12.3 27.87,12.3 27.37,12.8 27.37,21.05 26.87,21.55 v26.44,21.55
SDA  (via drill 0.31)
  Top 0.16: U5.9 8.01,16.01 8.12,15.9 v10.62,15.9 | v12.12,19.05 12.12,20.14 U2.27 12.11,21.36 v11.85,21.61 | v11.49,29.55 11.12,29.55 8.12,29.55 7.62,29.05 7.62,27.05 7.99,26.69 U1.9 | RPI.3 v11.49,29.55 | v11.49,29.55 v11.48,29.54 | v16.12,26.8 16.12,25.29 R1.2 | v15.17,21.61 15.12,21.55 15.12,25.05 15.37,25.3 16.48,25.3 R1.2 | R1.2 21.07,25.1 22.24,24.04 22.24,20.48 U4.15
  Bottom 0.16: v10.62,15.9 12.12,17.55 v12.12,19.05 | v11.48,29.54 14.87,29.55 15.37,29.05 15.37,27.55 v16.12,26.8 | v11.85,21.61 v15.17,21.61
TXD  (via drill 0.31)
  Top 0.16: RPI.8 16.56,32.11 16.37,32.3 2.12,32.3 0.87,31.05 0.87,2.8 v2.12,1.55 | v44.87,1.8 45.87,2.8 45.87,4.66 1-WIRE.3
  Bottom 0.16: v2.12,1.55 2.37,1.3 44.37,1.3 v44.87,1.8
VCC_I2C_1
  Bottom 0.16: I2C-0.3 18.73,6.16 18.75,6.18 | 18.75,6.18 21.12,8.55 22.06,8.55 JP1.2 | I2C-1.3 18.75,6.18
VCC_I2C_2
  Bottom 0.16: JP2.2 30.49,8.68 30.87,8.3 30.87,6.55 31.37,6.05 32.16,6.05 I2C-2.3 39.48,6.17 I2C-3.3

### Text on the board
tPlace: A1- | A1+ | A1- | A1+ | 3.3v | GND | 1 | 1 | M1 | M2 | 5v | GND | 12v | GND | GND | RX TX | 6 | 8 | M3 | M4
bPlace: PiHAT-BIOTECH 1.2v | 3.3v | 3.3v | 2017 | Created by Nanusefue/nanusefue@gmail.com